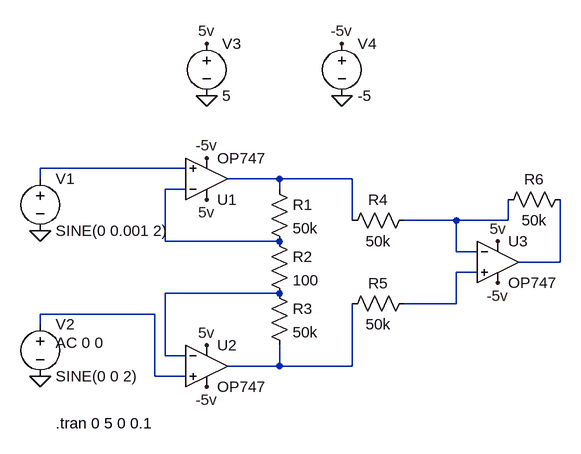
[diagram p0: schematic preamp.asc]
preamp.asc, the LTspice schematic file:
Version 4
SHEET 1 1124 680
WIRE 128 -560 -96 -560
WIRE -96 -544 -96 -560
WIRE 272 -544 192 -544
WIRE 384 -544 272 -544
WIRE 128 -528 96 -528
WIRE 272 -528 272 -544
WIRE 384 -480 384 -544
WIRE 544 -480 464 -480
WIRE 624 -480 624 -512
WIRE 624 -480 544 -480
WIRE 96 -448 96 -528
WIRE 272 -448 96 -448
WIRE 544 -432 544 -480
WIRE 576 -432 544 -432
WIRE 704 -416 704 -512
WIRE 704 -416 640 -416
WIRE 576 -400 544 -400
WIRE 272 -368 96 -368
WIRE 544 -352 544 -400
WIRE 544 -352 464 -352
WIRE 80 -336 -96 -336
WIRE -96 -320 -96 -336
WIRE 96 -272 96 -368
WIRE 128 -272 96 -272
WIRE 272 -256 272 -288
WIRE 272 -256 192 -256
WIRE 384 -256 384 -352
WIRE 384 -256 272 -256
WIRE 80 -240 80 -336
WIRE 128 -240 80 -240
FLAG -96 -464 0
FLAG -96 -240 0
FLAG 368 -672 0
FLAG 160 -672 0
FLAG 160 -752 5v
FLAG 160 -576 -5v
FLAG 160 -288 5v
FLAG 608 -448 5v
FLAG 368 -752 -5v
FLAG 608 -384 -5v
FLAG 160 -224 -5v
FLAG 160 -512 5v
SYMBOL voltage -96 -560 R0
WINDOW 123 0 0 Left 0
WINDOW 39 0 0 Left 0
SYMATTR InstName V1
SYMATTR Value SINE(0 0.001 2)
SYMBOL OpAmps\\OP747 160 -480 M180
SYMATTR InstName U1
SYMBOL OpAmps\\OP747 160 -320 R0
SYMATTR InstName U2
SYMBOL res 256 -544 R0
SYMATTR InstName R1
SYMATTR Value 50k
SYMBOL res 256 -464 R0
SYMATTR InstName R2
SYMATTR Value 100
SYMBOL res 256 -384 R0
SYMATTR InstName R3
SYMATTR Value 50k
SYMBOL res 480 -496 R90
WINDOW 0 0 56 VBottom 2
WINDOW 3 32 56 VTop 2
SYMATTR InstName R4
SYMATTR Value 50k
SYMBOL res 480 -368 R90
WINDOW 0 0 56 VBottom 2
WINDOW 3 32 56 VTop 2
SYMATTR InstName R5
SYMATTR Value 50k
SYMBOL OpAmps\\OP747 608 -480 R0
SYMATTR InstName U3
SYMBOL voltage -96 -336 R0
WINDOW 123 24 44 Left 2
WINDOW 39 0 0 Left 0
SYMATTR Value2 AC 0 0
SYMATTR InstName V2
SYMATTR Value SINE(0 0 2)
SYMBOL res 720 -528 R90
WINDOW 0 0 56 VBottom 2
WINDOW 3 32 56 VTop 2
SYMATTR InstName R6
SYMATTR Value 50k
SYMBOL voltage 160 -768 R0
WINDOW 123 0 0 Left 0
WINDOW 39 0 0 Left 0
SYMATTR InstName V3
SYMATTR Value 5
SYMBOL voltage 368 -768 R0
WINDOW 123 0 0 Left 0
WINDOW 39 0 0 Left 0
SYMATTR InstName V4
SYMATTR Value -5
TEXT -72 -168 Left 2 !.tran 0 5 0 0.1

The netlist it stands for:
* preamp.asc
V1 N001 0 SINE(0 0.001 2)
XU1 N001 N003 5v -5v N002 OP747  ; pins In+ In- V+ V- OUT
XU2 N008 N007 5v -5v N009 OP747  ; pins In+ In- V+ V- OUT
R1 N002 N003 50k
R2 N003 N007 100
R3 N007 N009 50k
R4 N004 N002 50k
R5 N006 N009 50k
XU3 N006 N004 5v -5v N005 OP747  ; pins In+ In- V+ V- OUT
V2 N008 0 SINE(0 0 2) AC 0 0
R6 N005 N004 50k
V3 5v 0 5
V4 -5v 0 -5
.tran 0 5 0 0.1
.backanno
.end